# EAGLE schematic linefollower (EAGLE 5.11)
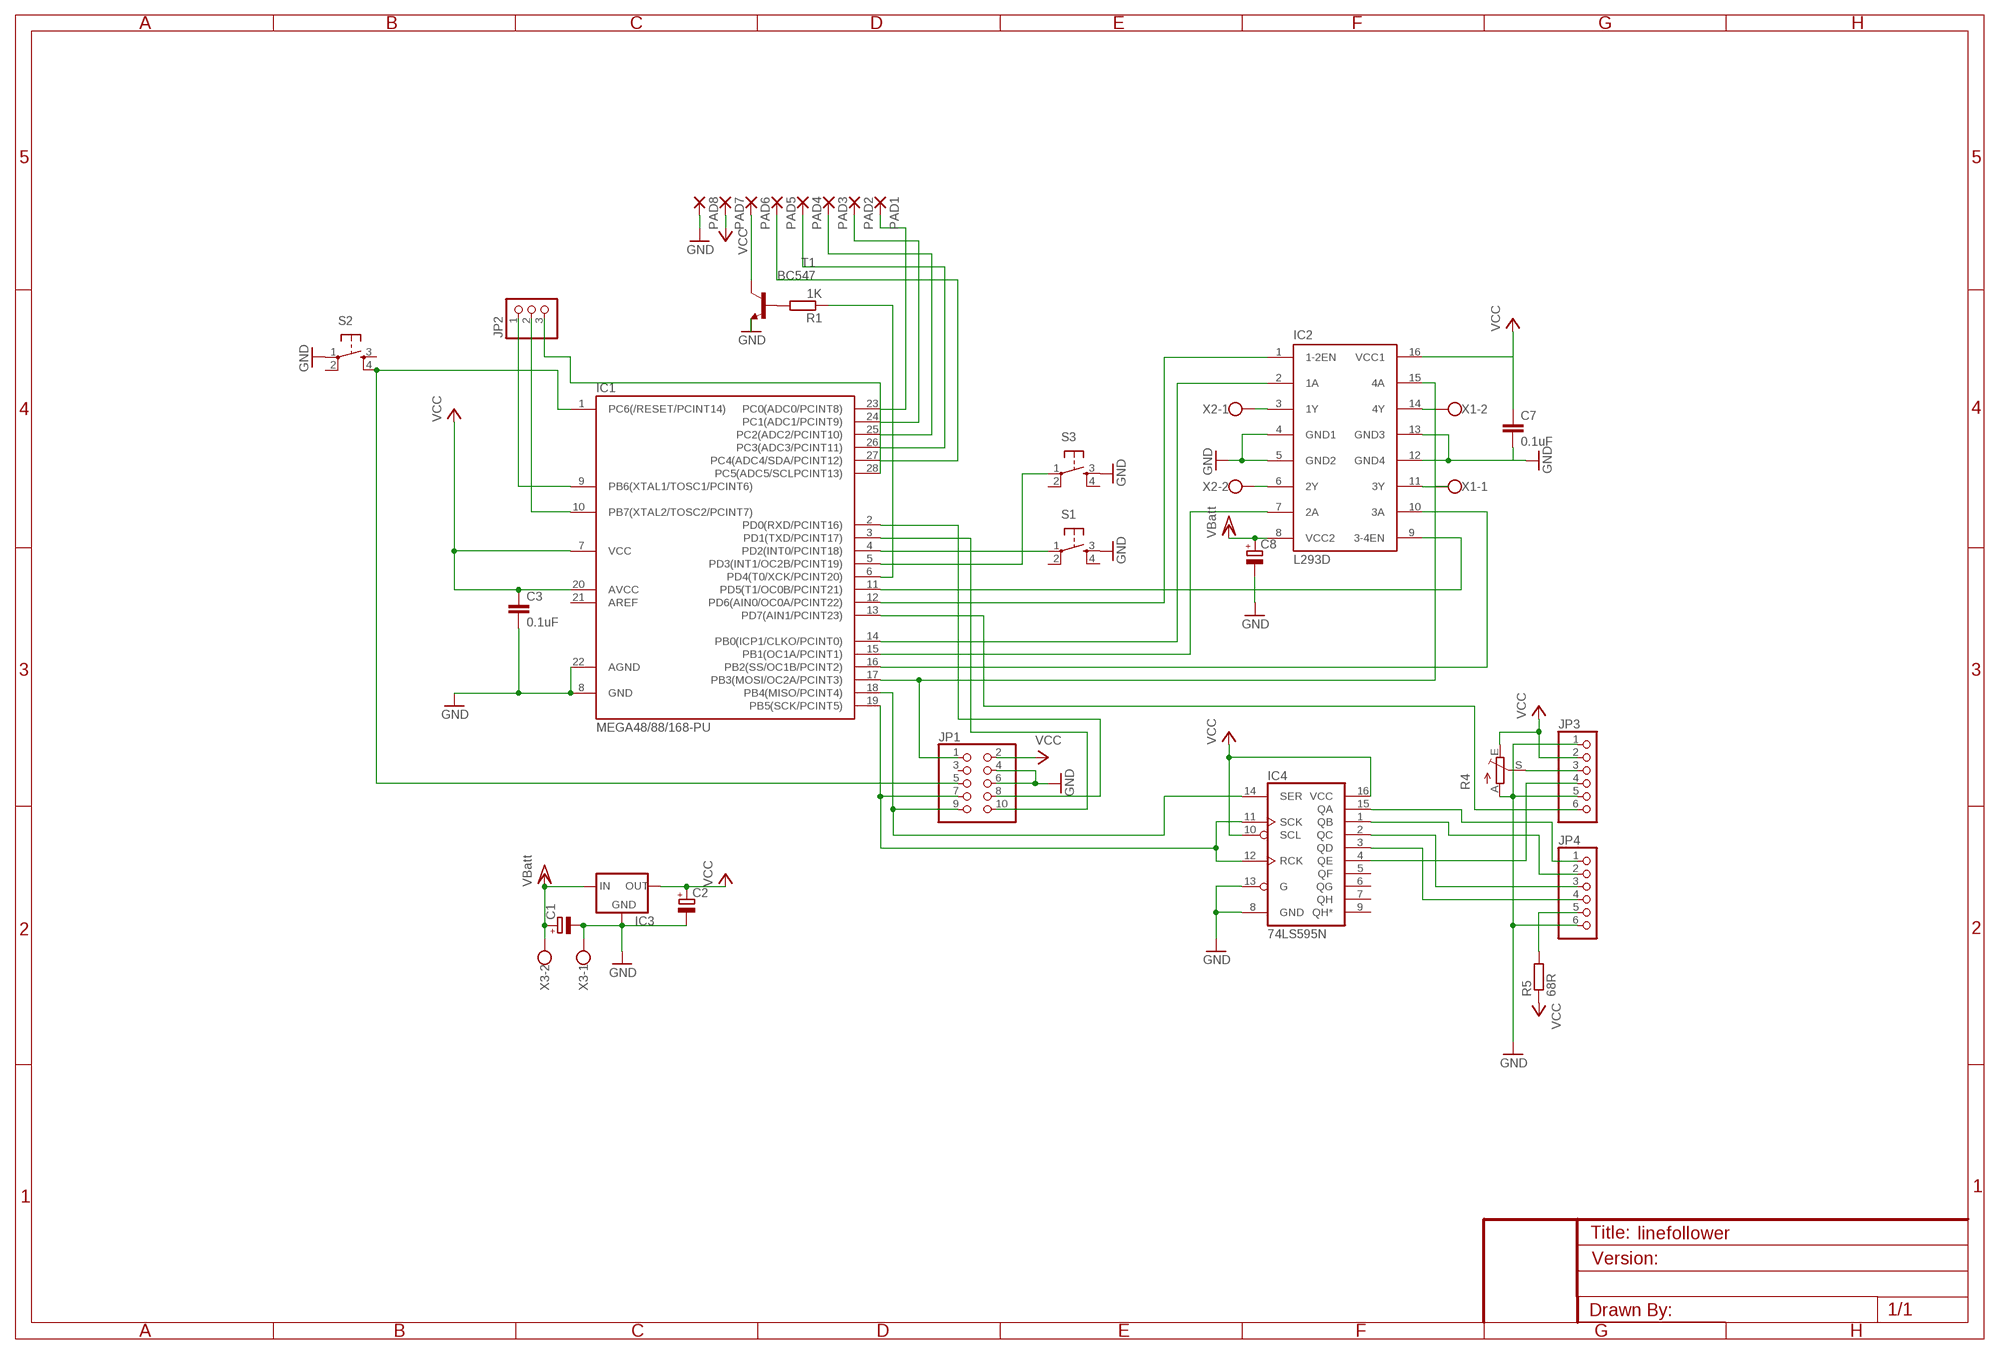
[diagram p0: schematic, sheet 1]

## Parts
C1  CPOL-EUE2,5-6E  [E2,5-6E]
C2  CPOL-EUE2,5-6E  [E2,5-6E]
C3  0.1uF  C-EU025-024X044  [C025-024X044]
C7  0.1uF  C-EU025-024X044  [C025-024X044]
C8  CPOL-EUE2,5-6E  [E2,5-6E]
IC1  MEGA48/88/168-PU  [DIL28-3]
IC2  L293D  [DIL16]
IC3  V_REG_78XXSIDE  [78XXL]
IC4  74LS595N  [DIL16]
JP1  PINHD-2X5  [2X05]
JP2  PINHD-1X3  [1X03]
JP3  PINHD-1X6  [1X06]
JP4  PINHD-1X6  [1X06]
PAD1  3,81/1,4  [3,81/1,4]
PAD2  3,81/1,4  [3,81/1,4]
PAD3  3,81/1,4  [3,81/1,4]
PAD4  3,81/1,4  [3,81/1,4]
PAD5  3,81/1,4  [3,81/1,4]
PAD6  3,81/1,4  [3,81/1,4]
PAD7  3,81/1,4  [3,81/1,4]
PAD8  3,81/1,4  [3,81/1,4]
R1  1K  R-EU_0204/7  [0204/7]
R4  TRIM_EU-LI10  [LI10]
R5  68R  R-EU_0204/7  [0204/7]
S1  TAC_SWITCHPTH  [TACTILE-PTH]
S2  TAC_SWITCHPTH  [TACTILE-PTH]
S3  TAC_SWITCHPTH  [TACTILE-PTH]
T1  BC547  [TO92]
X1  W237-102  [W237-102]
X2  W237-102  [W237-102]
X3  W237-102  [W237-102]

## Nets
GND: C1.- C2.- C3.2 C7.2 C8.- IC1.8(GND) IC1.22(AGND) IC2.4(GND1) IC2.5(GND2) IC2.12(GND4) IC2.13(GND3) IC3.GND IC4.8(GND) IC4.13(G) JP1.4 JP1.6 JP3.1 JP3.5 JP4.6 PAD8.1(P) R4.A S1.3 S2.1 S3.3 T1.1(E) X3.1
N$1: IC1.12(PD6(AIN0/OC0A/PCINT22)) IC2.1(1-2EN)
N$2: IC1.11(PD5(T1/OC0B/PCINT21)) IC2.9(3-4EN)
N$3: IC1.14(PB0(ICP1/CLKO/PCINT0)) IC2.2(1A)
N$4: IC1.15(PB1(OC1A/PCINT1)) IC2.7(2A)
N$5: IC1.16(PB2(SS/OC1B/PCINT2)) IC2.10(3A)
N$6: IC1.17(PB3(MOSI/OC2A/PCINT3)) IC2.15(4A) JP1.1
N$7: IC2.3(1Y) X2.1
N$8: IC2.6(2Y) X2.2
N$9: IC2.11(3Y) X1.1
N$10: IC2.14(4Y) X1.2
N$11: IC1.2(PD0(RXD/PCINT16)) JP1.8
N$12: IC1.3(PD1(TXD/PCINT17)) JP1.10
N$13: IC1.1(PC6(/RESET/PCINT14)) JP1.5 S2.4
N$14: IC1.19(PB5(SCK/PCINT5)) IC4.11(SCK) IC4.12(RCK) JP1.7
N$15: IC1.18(PB4(MISO/PCINT4)) IC4.14(SER) JP1.9
N$16: IC1.23(PC0(ADC0/PCINT8)) PAD1.1(P)
N$17: IC1.24(PC1(ADC1/PCINT9)) PAD2.1(P)
N$18: IC1.25(PC2(ADC2/PCINT10)) PAD3.1(P)
N$19: IC1.26(PC3(ADC3/PCINT11)) PAD4.1(P)
N$20: IC1.27(PC4(ADC4/SDA/PCINT12)) PAD5.1(P)
N$21: PAD6.1(P) T1.3(C)
N$22: R1.2 T1.2(B)
N$23: IC1.6(PD4(T0/XCK/PCINT20)) R1.1
N$24: IC1.4(PD2(INT0/PCINT18)) S1.1
N$25: IC1.5(PD3(INT1/OC2B/PCINT19)) S3.1
N$26: IC1.13(PD7(AIN1/PCINT23)) JP3.6
N$27: IC4.4(QE) JP3.4
N$28: IC4.15(QA) JP4.1
N$29: IC4.1(QB) JP4.2
N$30: IC4.2(QC) JP4.3
N$31: IC1.9(PB6(XTAL1/TOSC1/PCINT6)) JP2.1
N$32: IC4.3(QD) JP4.4
N$33: IC1.10(PB7(XTAL2/TOSC2/PCINT7)) JP2.2
N$34: JP3.3 R4.S
N$35: IC1.28(PC5(ADC5/SCLPCINT13)) JP2.3
N$40: JP4.5 R5.2
VCC: C2.+ C3.1 C7.1 IC1.7(VCC) IC1.20(AVCC) IC2.16(VCC1) IC3.OUT IC4.10(SCL) IC4.16(VCC) JP1.2 JP3.2 PAD7.1(P) R4.E R5.1
VCC/2: C1.+ C8.+ IC2.8(VCC2) IC3.IN X3.2 ; supply symbol labelled VBatt
Unconnected: IC1.21(AREF) IC4.5(QF) IC4.6(QG) IC4.7(QH) IC4.9(QH*) JP1.3 S1.2 S1.4 S2.2 S2.3 S3.2 S3.4

## Library data of the parts
C1 C2 C8 = resistor:CPOL-EU: POLARIZED CAPACITOR, European symbol
C3 C7 = resistor:C-EU: CAPACITOR, European symbol
IC1 = avr-6:MEGA48/88/168-PU
IC2 = st-microelectronics:L293D: PUSH-PULL 4 CHANNEL DRIVER; MPN: L293D; OC_FARNELL: 9589619; OC_NEWARK: 56P8249
IC3 = SparkFun:V_REG_78XX: Voltage Regulator Standard 7805 5V regulator. IGO (Input Ground Output). Spark Fun Electronics SKU : COM-00107
IC4 = SparkFun:74*595: 8-bit SHIFT REGISTER, output latch
JP1 = pinhead:PINHD-2X5: PIN HEADER
JP2 = pinhead:PINHD-1X3: PIN HEADER
JP3 JP4 = pinhead:PINHD-1X6: PIN HEADER
PAD1-PAD8 = wirepad:3,81/1,4: THROUGH-HOLE PAD
R1 R5 = resistor:R-EU_: RESISTOR, European symbol
R4 = pot:TRIM_EU-: POTENTIOMETER
S1-S3 = SparkFun:TAC_SWITCH: Momentary Switch Button commonly used for reset or general input. Spark Fun Electronics SKU : COM-00097
T1 = transistor:BC547: NPN TRANSISTOR
X1-X3 = con-wago-500:W237-102: WAGO SCREW CLAMP; MPN: 237-102; OC_FARNELL: unknown; OC_NEWARK: 70K9898